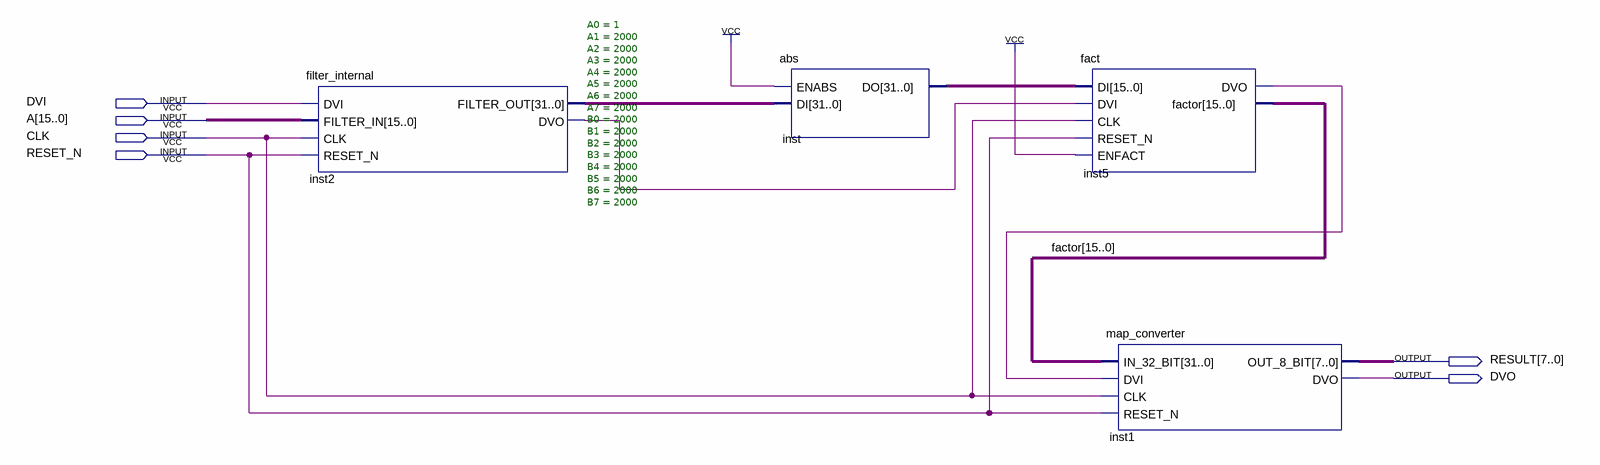
[diagram p0: schematic sheet]
// Quartus schematic Filter.bdf as structural Verilog: 4 symbols, 6 pins
module Filter (
  input  DVI,
  input  [15:0] A,
  input  CLK,
  input  RESET_N,
  output [7:0] RESULT,
  output DVO
);

  wire inst2_dvo, inst5_dvo;
  wire [15:0] factor;
  wire [31:0] inst2_filter_out, inst_do;

  filter_internal #(.A0(1), .A1(2000), .A2(2000), .A3(2000), .A4(2000), .A5(2000), .A6(2000), .A7(2000), .B0(2000), .B1(2000), .B2(2000), .B3(2000), .B4(2000), .B5(2000), .B6(2000), .B7(2000)) inst2 (
    .DVI(DVI), .FILTER_IN(A), .CLK(CLK), .RESET_N(RESET_N), .FILTER_OUT(inst2_filter_out), .DVO(inst2_dvo));
  abs inst (.ENABS(1'b1), .DI(inst2_filter_out), .DO(inst_do));
  fact inst5 (
    .DI(inst_do), .DVI(inst2_dvo), .CLK(CLK), .RESET_N(RESET_N), .ENFACT(1'b1), .DVO(inst5_dvo),
    .factor(factor));
  map_converter inst1 (
    .IN_32_BIT(factor), .DVI(inst5_dvo), .CLK(CLK), .RESET_N(RESET_N), .OUT_8_BIT(RESULT), .DVO(DVO));
endmodule
